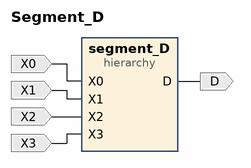
[diagram p0: block diagram of the top level]
# Vivado block design Segment_D, xc7a35tcpg236-1, Vivado 2018.3
create_bd_design Segment_D

create_bd_port -dir O D
create_bd_port -dir I X0
create_bd_port -dir I X1
create_bd_port -dir I X2
create_bd_port -dir I X3

create_bd_cell -type hier segment_D

# ---- hierarchy /segment_D ----
current_bd_instance /segment_D
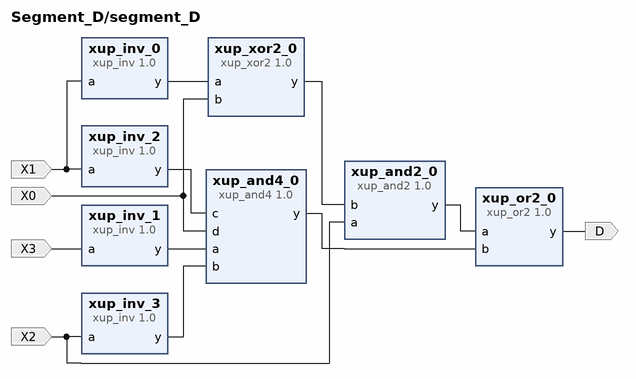
[diagram p1: block diagram inside /segment_D]
create_bd_pin -dir I X0
create_bd_pin -dir I X1
create_bd_pin -dir I X3
create_bd_pin -dir I X2
create_bd_pin -dir O D

create_bd_cell -type ip -vlnv xilinx.com:xup:xup_and4:1.0 xup_and4_0
set_property -dict {CONFIG.DELAY 0} [get_bd_cells xup_and4_0]
create_bd_cell -type ip -vlnv xilinx.com:xup:xup_xor2:1.0 xup_xor2_0
set_property -dict {CONFIG.DELAY 0} [get_bd_cells xup_xor2_0]
create_bd_cell -type ip -vlnv xilinx.com:xup:xup_inv:1.0 xup_inv_0
set_property -dict {CONFIG.DELAY 0} [get_bd_cells xup_inv_0]
create_bd_cell -type ip -vlnv xilinx.com:xup:xup_inv:1.0 xup_inv_1
set_property -dict {CONFIG.DELAY 0} [get_bd_cells xup_inv_1]
create_bd_cell -type ip -vlnv xilinx.com:xup:xup_inv:1.0 xup_inv_2
set_property -dict {CONFIG.DELAY 0} [get_bd_cells xup_inv_2]
create_bd_cell -type ip -vlnv xilinx.com:xup:xup_and2:1.0 xup_and2_0
set_property -dict {CONFIG.DELAY 0} [get_bd_cells xup_and2_0]
create_bd_cell -type ip -vlnv xilinx.com:xup:xup_inv:1.0 xup_inv_3
set_property -dict {CONFIG.DELAY 0} [get_bd_cells xup_inv_3]
create_bd_cell -type ip -vlnv xilinx.com:xup:xup_or2:1.0 xup_or2_0
set_property -dict {CONFIG.DELAY 0} [get_bd_cells xup_or2_0]

# ---- connections ----

current_bd_instance /segment_D
connect_bd_net [get_bd_pins xup_inv_1/y] [get_bd_pins xup_and4_0/a]
connect_bd_net [get_bd_pins xup_inv_3/y] [get_bd_pins xup_and4_0/b]
connect_bd_net [get_bd_pins xup_inv_2/y] [get_bd_pins xup_and4_0/c]
connect_bd_net [get_bd_pins xup_and4_0/y] [get_bd_pins xup_or2_0/b]
connect_bd_net [get_bd_pins xup_inv_0/y] [get_bd_pins xup_xor2_0/a]
connect_bd_net [get_bd_pins xup_xor2_0/y] [get_bd_pins xup_and2_0/b]
connect_bd_net [get_bd_pins xup_and2_0/y] [get_bd_pins xup_or2_0/a]
connect_bd_net -net d_0_1 [get_bd_pins X0] [get_bd_pins xup_xor2_0/b] [get_bd_pins xup_and4_0/d]
connect_bd_net -net a_0_1 [get_bd_pins X1] [get_bd_pins xup_inv_2/a] [get_bd_pins xup_inv_0/a]
connect_bd_net -net a_2_1 [get_bd_pins X3] [get_bd_pins xup_inv_1/a]
connect_bd_net -net a_1_1 [get_bd_pins X2] [get_bd_pins xup_inv_3/a] [get_bd_pins xup_and2_0/a]
connect_bd_net [get_bd_pins xup_or2_0/y] [get_bd_pins D]

current_bd_instance /
connect_bd_net -net xup_or2_0_y [get_bd_pins segment_D/D] [get_bd_ports D]
connect_bd_net -net d_0_1 [get_bd_ports X0] [get_bd_pins segment_D/X0]
connect_bd_net -net a_0_1 [get_bd_ports X1] [get_bd_pins segment_D/X1]
connect_bd_net -net a_1_1 [get_bd_ports X2] [get_bd_pins segment_D/X2]
connect_bd_net -net a_2_1 [get_bd_ports X3] [get_bd_pins segment_D/X3]

validate_bd_design
save_bd_design
